# Altium schematic sheet PowerAmplifier.SchDoc
size Legal; CompanyName: Ploopy Corporation; Organization: Ploopy Corporation; Address1: Suite 226, 137-1140 Burnhamthorpe Road W; Address2: Mississauga; Address3: Ontario; Address4: Canada L5C 0A3; DocumentNumber: 10; Revision: R1.007; SheetNumber: 10; SheetTotal: 11
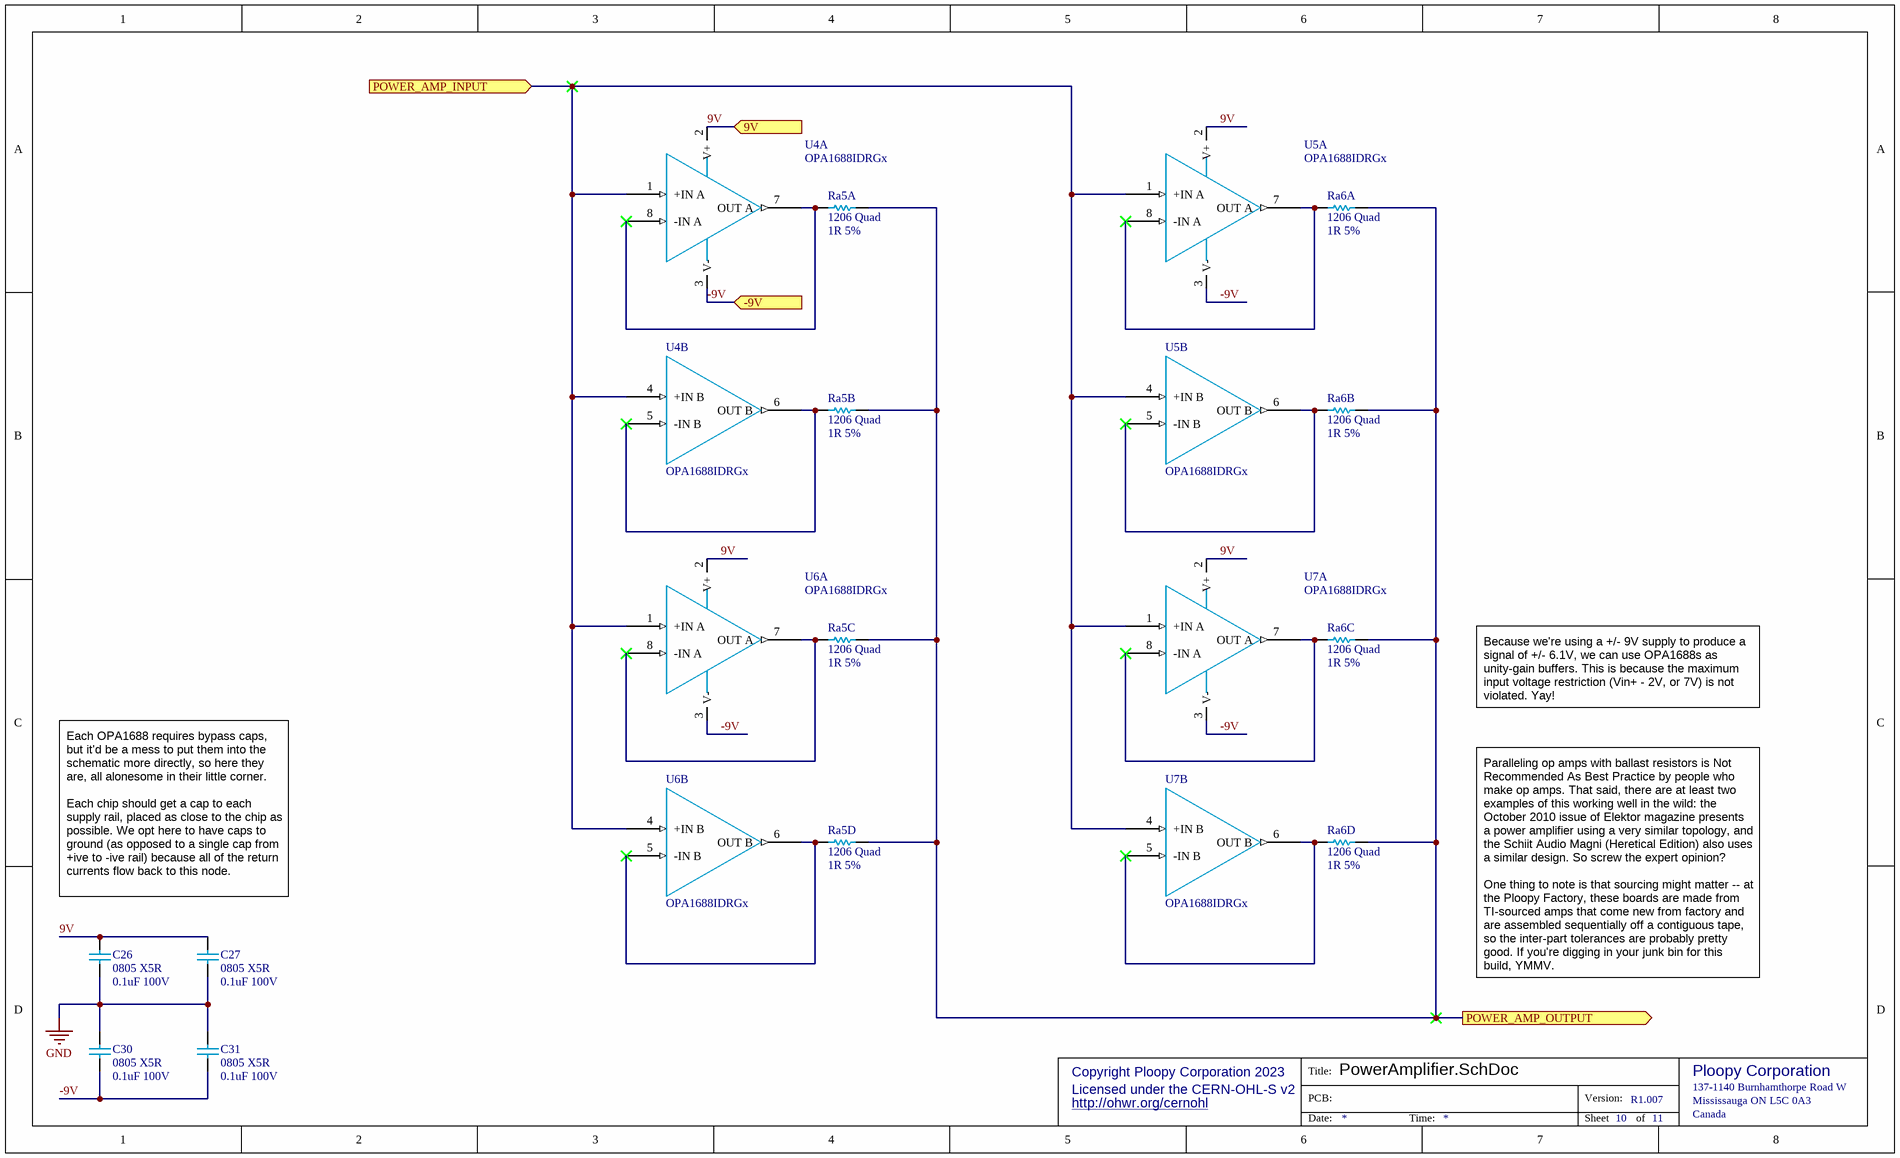
[diagram p0: PowerAmplifier.SchDoc]

## Parts
C26  0805 X5R  value 0.1uF 100V  [0805 - TALL]
C27  0805 X5R  value 0.1uF 100V  [0805 - TALL]
C30  0805 X5R  value 0.1uF 100V  [0805 - TALL]
C31  0805 X5R  value 0.1uF 100V  [0805 - TALL]
Ra5  1206 Quad  value 1R 5%  [4x 1R 5% - CAC-80P320X160-8M]  (parts A,B,C,D of 4)
Ra6  1206 Quad  value 1R 5%  [4x 1R 5% - CAC-80P320X160-8M]  (parts A,B,C,D of 4)
U4  OPA1688IDRGx  [OPA1688 - SON50P300X80_HS-9M]  (parts A,B of 2)
U5  OPA1688IDRGx  [OPA1688 - SON50P300X80_HS-9M]  (parts A,B of 2)
U6  OPA1688IDRGx  [OPA1688 - SON50P300X80_HS-9M]  (parts A,B of 2)
U7  OPA1688IDRGx  [OPA1688 - SON50P300X80_HS-9M]  (parts A,B of 2)

## Ports
9V (in), -9V (in), POWER_AMP_INPUT (in), POWER_AMP_OUTPUT (out)

## Nets
GND: C26.1 C27.1 C30.2 C31.2
9V: C26.2 C27.2 U4.2(V+) U5.2(V+) U6.2(V+) U7.2(V+) ; port 9V
-9V: C30.1 C31.1 U4.3(V-) U5.3(V-) U6.3(V-) U7.3(V-) ; port -9V
POWER_AMP_INPUT: U4.1(+IN_A) U4.4(+IN_B) U5.1(+IN_A) U5.4(+IN_B) U6.1(+IN_A) U6.4(+IN_B) U7.1(+IN_A) U7.4(+IN_B) ; port POWER_AMP_INPUT
POWER_AMP_OUTPUT: Ra5.5 Ra5.6 Ra5.7 Ra5.8 Ra6.5 Ra6.6 Ra6.7 Ra6.8 ; port POWER_AMP_OUTPUT
NetRa5_1: Ra5.1 U4.7(OUT_A) U4.8(-IN_A)
NetRa5_2: Ra5.2 U4.5(-IN_B) U4.6(OUT_B)
NetRa5_3: Ra5.3 U6.7(OUT_A) U6.8(-IN_A)
NetRa5_4: Ra5.4 U6.5(-IN_B) U6.6(OUT_B)
NetRa6_1: Ra6.1 U5.7(OUT_A) U5.8(-IN_A)
NetRa6_2: Ra6.2 U5.5(-IN_B) U5.6(OUT_B)
NetRa6_3: Ra6.3 U7.7(OUT_A) U7.8(-IN_A)
NetRa6_4: Ra6.4 U7.5(-IN_B) U7.6(OUT_B)

## Notes on the sheet
- Because we're using a +/- 9V supply to produce a signal of +/- 6.1V, we can use OPA1688s as unity-gain buffers. This is because the maximum input voltage restriction (Vin+ - 2V, or 7V) is not violated. Yay!
- Each OPA1688 requires bypass caps, but it'd be a mess to put them into the schematic more directly, so here they are, all alonesome in their little corner.
  Each chip should get a cap to each supply rail, placed as close to the chip as possible. We opt here to have caps to ground (as opposed to a single cap from +ive to -ive rail) because all of the return currents flow back to this node.
- Paralleling op amps with ballast resistors is Not Recommended As Best Practice by people who make op amps. That said, there are at least two examples of this working well in the wild: the October 2010 issue of Elektor magazine presents a power amplifier using a very similar topology, and the Schiit Audio Magni (Heretical Edition) also uses a similar design. So screw the expert opinion?
  One thing to note is that sourcing might matter -- at the Ploopy Factory, these boards are made from TI-sourced amps that come new from factory and are assembled sequentially off a contiguous tape, so the inter-part tolerances are probably pretty good. If you're digging in your junk bin for this build, YMMV.
- Copyright Ploopy Corporation 2023
- Licensed under the CERN-OHL-S v2
- http://ohwr.org/cernohl
- Title:
- PCB:
- Version:
- Ploopy Corporation
- Mississauga ON L5C 0A3
- 137-1140 Burnhamthorpe Road W
- Date:
- Time:
- Sheet
- of
- Canada

## Library data of the parts
C26 C27 C30 C31 = Cap 0.1uF 100V: 0805, X5R or better; Supplier 1: Digi-Key; Supplier Part Number 1: 1276-6840-2-ND
Ra5 Ra6 = Quad Res 1R 5% 1206: Chip resistor
U4-U7 = OPA1688IDRGx: 36V, 10MHz, Low Distortion High Drive Rail-to-Rail Output Audio Operational Amplifiers; Supplier 1: Arrow Electronics; Supplier 2: Mouser; Supplier Part Number 2: 595-OPA1688IDRGR; Supplier Part Number 1: OPA1688IDRGR